# Altium schematic sheet ESP32-C3_V01.SchDoc: ESP32-C3 Haptic Motor
size A3; Author: Dwayne Herzberg; DrawnBy: Dwayne Herzberg; Revision: V1; SheetNumber: 1; SheetTotal: 1
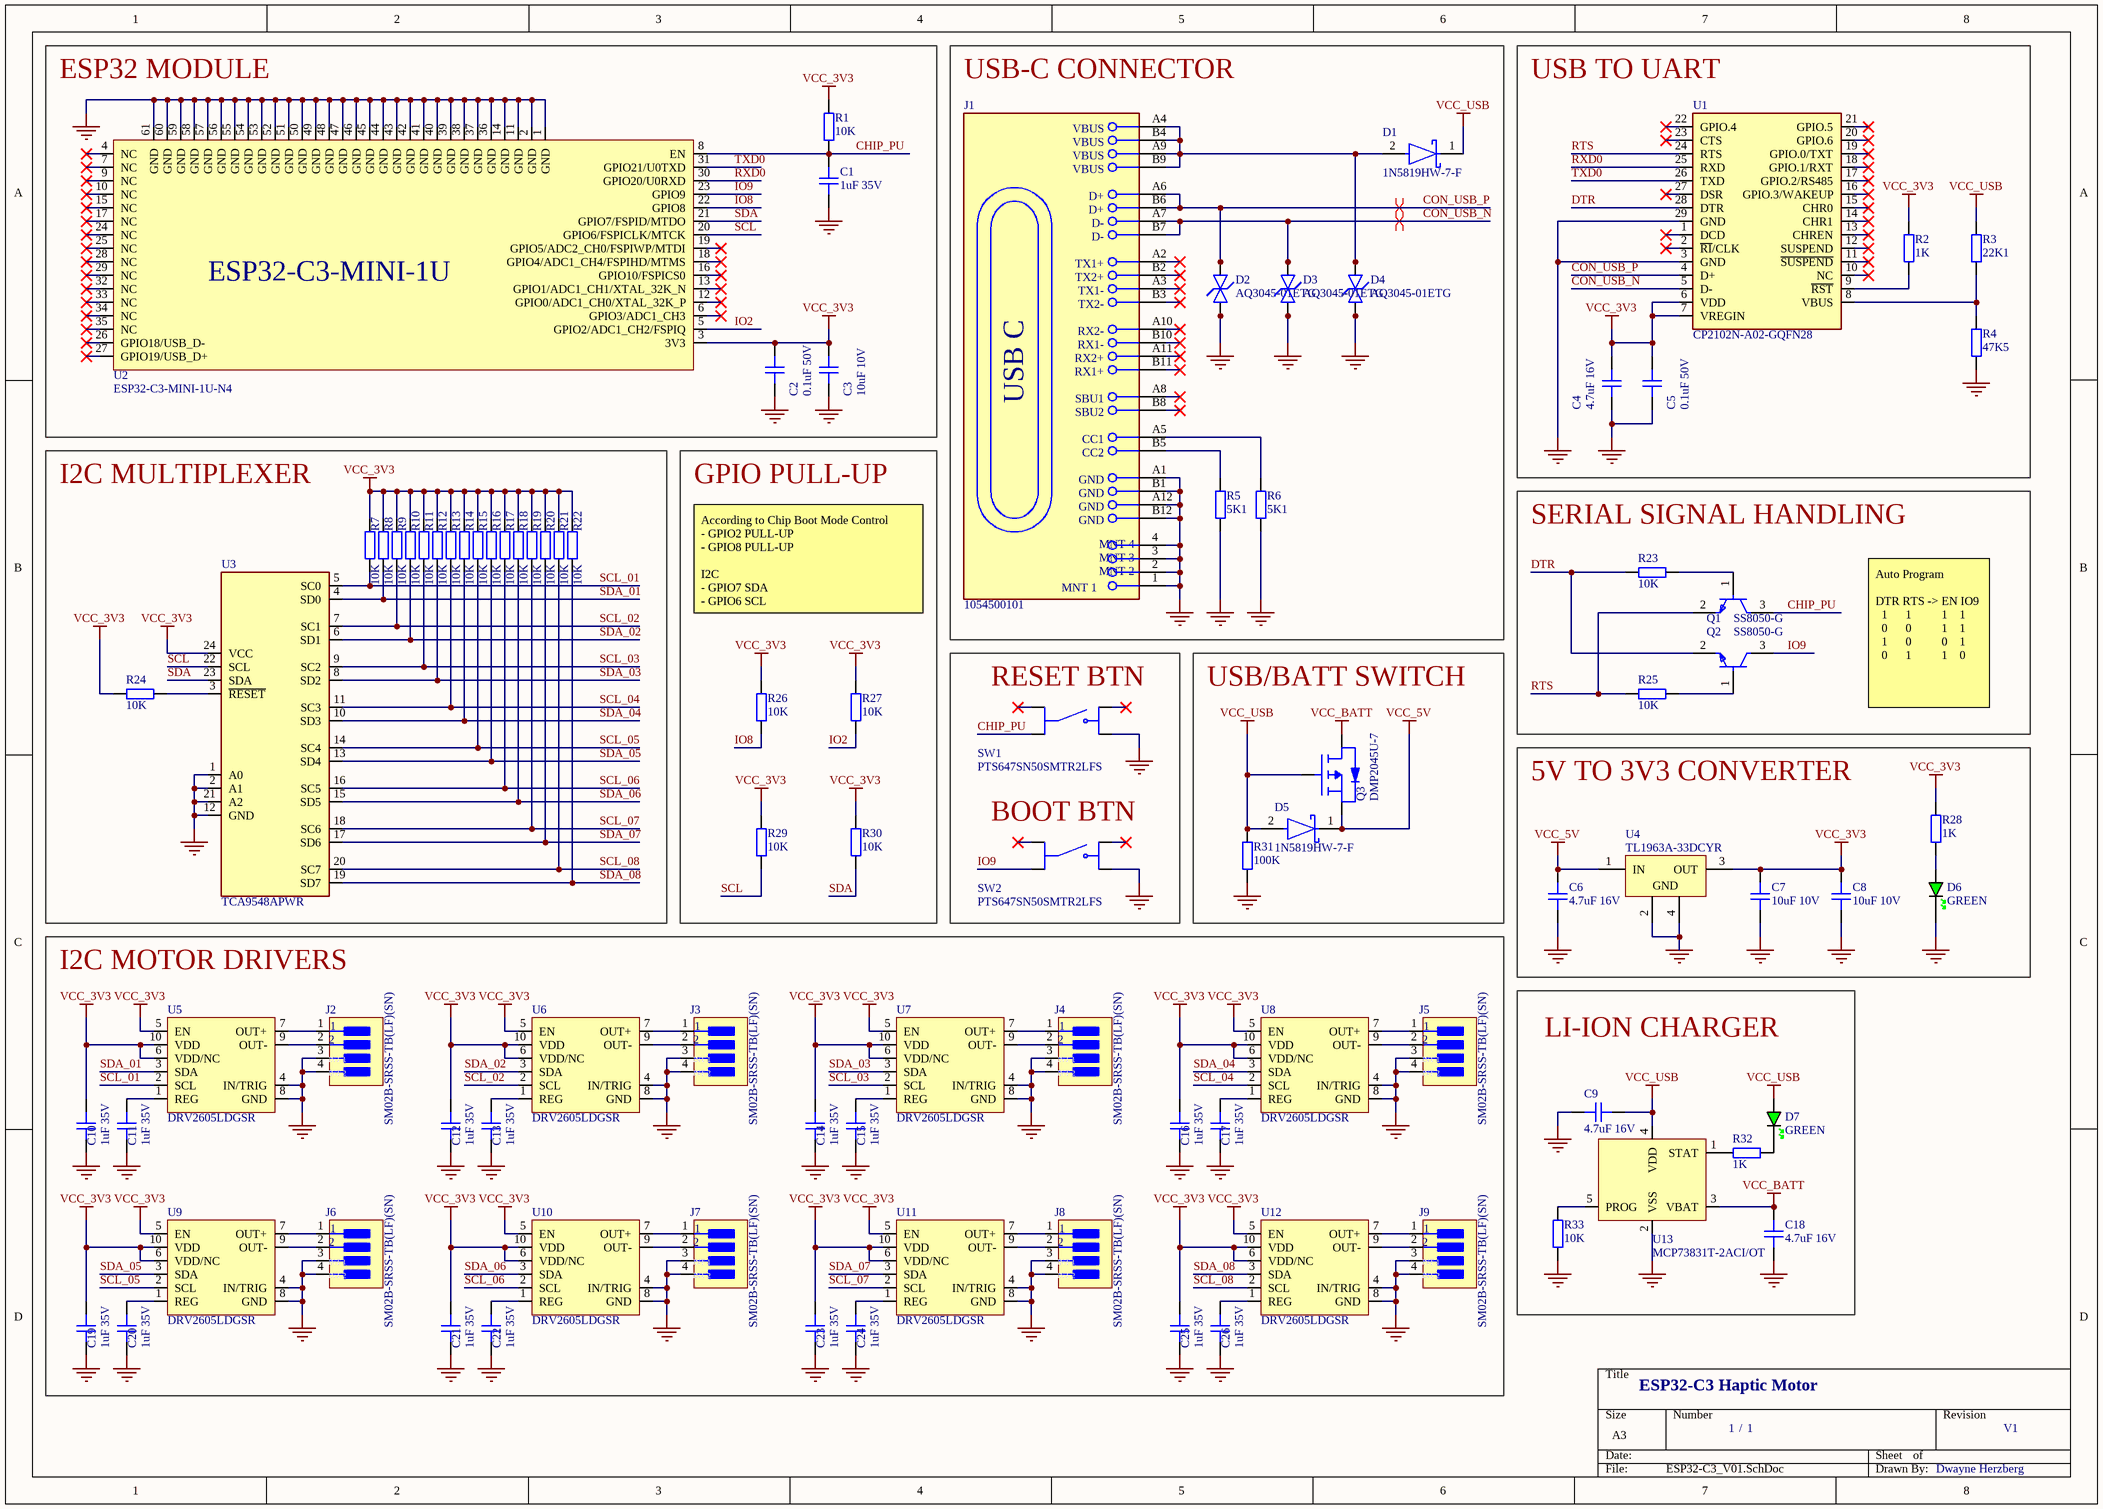
[diagram p0: ESP32-C3_V01.SchDoc]

## Parts
C1  1uF 35V  [CAP_0402]
C2  0.1uF 50V  [CAP_0402]
C3  10uF 10V  [CAP_0402]
C4  4.7uF 16V  [CAP_0402]
C5  0.1uF 50V  [CAP_0402]
C6  4.7uF 16V  [CAP_0402]
C7  10uF 10V  [CAP_0402]
C8  10uF 10V  [CAP_0402]
C9  4.7uF 16V  [CAP_0402]
C10  1uF 35V  [CAP_0402]
C11  1uF 35V  [CAP_0402]
C12  1uF 35V  [CAP_0402]
C13  1uF 35V  [CAP_0402]
C14  1uF 35V  [CAP_0402]
C15  1uF 35V  [CAP_0402]
C16  1uF 35V  [CAP_0402]
C17  1uF 35V  [CAP_0402]
C18  4.7uF 16V  [CAP_0402]
C19  1uF 35V  [CAP_0402]
C20  1uF 35V  [CAP_0402]
C21  1uF 35V  [CAP_0402]
C22  1uF 35V  [CAP_0402]
C23  1uF 35V  [CAP_0402]
C24  1uF 35V  [CAP_0402]
C25  1uF 35V  [CAP_0402]
C26  1uF 35V  [CAP_0402]
D1  1N5819HW-7-F  [FP-SOD123-IPC_B]
D2  AQ3045-01ETG  [SP353001ETG]
D3  AQ3045-01ETG  [SP353001ETG]
D4  AQ3045-01ETG  [SP353001ETG]
D5  1N5819HW-7-F  [FP-SOD123-IPC_B]
D6  GREEN  [LED_0603_GREEN]
D7  GREEN  [LED_0603_GREEN]
J1  1054500101  [FP-1054500101-MFG]
J2  SM02B-SRSS-TB(LF)(SN)  [FP-SM02B-SRSS-TB_LF_SN-MFG]
J3  SM02B-SRSS-TB(LF)(SN)  [FP-SM02B-SRSS-TB_LF_SN-MFG]
J4  SM02B-SRSS-TB(LF)(SN)  [FP-SM02B-SRSS-TB_LF_SN-MFG]
J5  SM02B-SRSS-TB(LF)(SN)  [FP-SM02B-SRSS-TB_LF_SN-MFG]
J6  SM02B-SRSS-TB(LF)(SN)  [FP-SM02B-SRSS-TB_LF_SN-MFG]
J7  SM02B-SRSS-TB(LF)(SN)  [FP-SM02B-SRSS-TB_LF_SN-MFG]
J8  SM02B-SRSS-TB(LF)(SN)  [FP-SM02B-SRSS-TB_LF_SN-MFG]
J9  SM02B-SRSS-TB(LF)(SN)  [FP-SM02B-SRSS-TB_LF_SN-MFG]
Q1  SS8050-G  [FP-SS8050-G-IPC_B]
Q2  SS8050-G  [FP-SS8050-G-IPC_B]
Q3  DMP2045U-7  [SOT96P240X115-3N]
R1  10K  [RES_0402]
R2  1K  [RES_0402]
R3  22K1  [RES_0402]
R4  47K5  [RES_0402]
R5  5K1  [RES_0402]
R6  5K1  [RES_0402]
R7  10K  [RES_0402]
R8  10K  [RES_0402]
R9  10K  [RES_0402]
R10  10K  [RES_0402]
R11  10K  [RES_0402]
R12  10K  [RES_0402]
R13  10K  [RES_0402]
R14  10K  [RES_0402]
R15  10K  [RES_0402]
R16  10K  [RES_0402]
R17  10K  [RES_0402]
R18  10K  [RES_0402]
R19  10K  [RES_0402]
R20  10K  [RES_0402]
R21  10K  [RES_0402]
R22  10K  [RES_0402]
R23  10K  [RES_0402]
R24  10K  [RES_0402]
R25  10K  [RES_0402]
R26  10K  [RES_0402]
R27  10K  [RES_0402]
R28  1K  [RES_0402]
R29  10K  [RES_0402]
R30  10K  [RES_0402]
R31  100K  [RES_0402]
R32  1K  [RES_0402]
R33  10K  [RES_0402]
SW1  PTS647SN50SMTR2LFS  [PTS 647 SN50 SMTR2 LFS]
SW2  PTS647SN50SMTR2LFS  [PTS 647 SN50 SMTR2 LFS]
U1  CP2102N-A02-GQFN28  [FP-CP2102N-A02-GQFN28-IPC_B]
U2  ESP32-C3-MINI-1U-N4  [ESP32-C3-MINI-1U_EXP]
U3  TCA9548APWR  [FP-PW0024A-IPC_B]
U4  TL1963A-33DCYR  [DCY0004A_L]
U5  DRV2605LDGSR  [FP-DGS0010A-IPC_B]
U6  DRV2605LDGSR  [FP-DGS0010A-IPC_B]
U7  DRV2605LDGSR  [FP-DGS0010A-IPC_B]
U8  DRV2605LDGSR  [FP-DGS0010A-IPC_B]
U9  DRV2605LDGSR  [FP-DGS0010A-IPC_B]
U10  DRV2605LDGSR  [FP-DGS0010A-IPC_B]
U11  DRV2605LDGSR  [FP-DGS0010A-IPC_B]
U12  DRV2605LDGSR  [FP-DGS0010A-IPC_B]
U13  MCP73831T-2ACI/OT  [FP-C04-091-OT-IPC_B]

## Blocks framed on the sheet
ESP32 MODULE: C1-C3 R1 U2
USB-C CONNECTOR: D1-D4 J1 R5 R6
USB TO UART: C4 C5 R2-R4 U1
I2C MULTIPLEXER: R7-R22 R24 U3
GPIO PULL-UP: R26 R27 R29 R30
SERIAL SIGNAL HANDLING: Q1 Q2 R23 R25
USB/BATT SWITCH: D5 Q3 R31
5V TO 3V3 CONVERTER: C6-C8 D6 R28 U4
I2C MOTOR DRIVERS: C10-C17 C19-C26 J2-J9 U5-U12
LI-ION CHARGER: C9 C18 D7 R32 R33 U13

## Nets
GND: C1.1 C2.1 C3.1 C4.1 C5.1 C6.1 C7.1 C8.1 C9.2 C10.1 C11.1 C12.1 C13.1 C14.1 C15.1 C16.1 C17.1 C18.2 C19.1 C20.1 C21.1 C22.1 C23.1 C24.1 C25.1 C26.1 D2.1(A) D2.A D3.1(A) D3.A D4.1(A) D4.A D6.K J1.1(MNT_1) J1.2(MNT_2) J1.3(MNT_3) J1.4(MNT_4) J1.A1(GND) J1.A12(GND) J1.B1(GND) J1.B12(GND) J2.3(MNT_1) J2.4(MNT_2) J3.3(MNT_1) J3.4(MNT_2) J4.3(MNT_1) J4.4(MNT_2) J5.3(MNT_1) J5.4(MNT_2) J6.3(MNT_1) J6.4(MNT_2) J7.3(MNT_1) J7.4(MNT_2) J8.3(MNT_1) J8.4(MNT_2) J9.3(MNT_1) J9.4(MNT_2) R4.1 R5.1 R6.1 R31.1 R33.1 SW1.4(NO) SW2.4(NO) U1.3(GND) U1.29(GND) U2.1(GND) U2.2(GND) U2.11(GND) U2.14(GND) U2.36(GND) U2.37(GND) U2.38(GND) U2.39(GND) U2.40(GND) U2.41(GND) U2.42(GND) U2.43(GND) U2.44(GND) U2.45(GND) U2.46(GND) U2.47(GND) U2.48(GND) U2.49(GND) U2.50(GND) U2.51(GND) U2.52(GND) U2.53(GND) U2.54(GND) U2.55(GND) U2.56(GND) U2.57(GND) U2.58(GND) U2.59(GND) U2.60(GND) U2.61(GND) U3.1(A0) U3.2(A1) U3.12(GND) U3.21(A2) U4.2(GND) U4.4(GND) U5.4(IN/TRIG) U5.8(GND) U6.4(IN/TRIG) U6.8(GND) U7.4(IN/TRIG) U7.8(GND) U8.4(IN/TRIG) U8.8(GND) U9.4(IN/TRIG) U9.8(GND) U10.4(IN/TRIG) U10.8(GND) U11.4(IN/TRIG) U11.8(GND) U12.4(IN/TRIG) U12.8(GND) U13.2(VSS)
VCC_3V3: C2.2 C3.2 C4.2 C5.2 C7.2 C8.2 C10.2 C12.2 C14.2 C16.2 C19.2 C21.2 C23.2 C25.2 R1.2 R2.2 R7.2 R8.2 R9.2 R10.2 R11.2 R12.2 R13.2 R14.2 R15.2 R16.2 R17.2 R18.2 R19.2 R20.2 R21.2 R22.2 R24.2 R26.2 R27.2 R28.2 R29.2 R30.2 U1.6(VDD) U1.7(VREGIN) U2.3(3V3) U3.24(VCC) U4.3(OUT) U5.5(EN) U5.6(VDD/NC) U5.10(VDD) U6.5(EN) U6.6(VDD/NC) U6.10(VDD) U7.5(EN) U7.6(VDD/NC) U7.10(VDD) U8.5(EN) U8.6(VDD/NC) U8.10(VDD) U9.5(EN) U9.6(VDD/NC) U9.10(VDD) U10.5(EN) U10.6(VDD/NC) U10.10(VDD) U11.5(EN) U11.6(VDD/NC) U11.10(VDD) U12.5(EN) U12.6(VDD/NC) U12.10(VDD)
VCC_5V: C6.2 D5.1(C) Q3.2(S) U4.1(IN)
VCC_BATT: C18.1 Q3.3(D) U13.3(VBAT)
VCC_USB: C9.1 D1.1(C) D5.2(A) D7.A Q3.1(G) R3.2 R31.2 U13.4(VDD)
CHIP_PU: C1.2 Q1.3(C) R1.1 SW1.3(NO) U2.8(EN)
CON_USB_N: D3.2(K) D3.K J1.A7(D-) J1.B7(D-) U1.5(D-)
CON_USB_P: D2.2(K) D2.K J1.A6(D+) J1.B6(D+) U1.4(D+)
DTR: Q2.2(E) R23.2 U1.28(DTR)
IO2: R27.1 U2.5(GPIO2/ADC1_CH2/FSPIQ)
IO8: R26.1 U2.22(GPIO8)
IO9: Q2.3(C) SW2.3(NO) U2.23(GPIO9)
RTS: Q1.2(E) R25.2 U1.24(RTS)
RXD0: U1.25(RXD) U2.30(GPIO20/U0RXD)
SCL: R29.1 U2.20(GPIO6/FSPICLK/MTCK) U3.22(SCL)
SCL_01: R7.1 U3.5(SC0) U5.2(SCL)
SCL_02: R9.1 U3.7(SC1) U6.2(SCL)
SCL_03: R11.1 U3.9(SC2) U7.2(SCL)
SCL_04: R13.1 U3.11(SC3) U8.2(SCL)
SCL_05: R15.1 U3.14(SC4) U9.2(SCL)
SCL_06: R17.1 U3.16(SC5) U10.2(SCL)
SCL_07: R19.1 U3.18(SC6) U11.2(SCL)
SCL_08: R21.1 U3.20(SC7) U12.2(SCL)
SDA: R30.1 U2.21(GPIO7/FSPID/MTDO) U3.23(SDA)
SDA_01: R8.1 U3.4(SD0) U5.3(SDA)
SDA_02: R10.1 U3.6(SD1) U6.3(SDA)
SDA_03: R12.1 U3.8(SD2) U7.3(SDA)
SDA_04: R14.1 U3.10(SD3) U8.3(SDA)
SDA_05: R16.1 U3.13(SD4) U9.3(SDA)
SDA_06: R18.1 U3.15(SD5) U10.3(SDA)
SDA_07: R20.1 U3.17(SD6) U11.3(SDA)
SDA_08: R22.1 U3.19(SD7) U12.3(SDA)
TXD0: U1.26(TXD) U2.31(GPIO21/U0TXD)
NetC11_2: C11.2 U5.1(REG)
NetC13_2: C13.2 U6.1(REG)
NetC15_2: C15.2 U7.1(REG)
NetC17_2: C17.2 U8.1(REG)
NetC20_2: C20.2 U9.1(REG)
NetC22_2: C22.2 U10.1(REG)
NetC24_2: C24.2 U11.1(REG)
NetC26_2: C26.2 U12.1(REG)
NetD1_2: D1.2(A) D4.2(K) D4.K J1.A4(VBUS) J1.A9(VBUS) J1.B4(VBUS) J1.B9(VBUS)
NetD6_A: D6.A R28.1
NetD7_K: D7.K R32.1
NetJ1_A5: J1.A5(CC1) R6.2
NetJ1_B5: J1.B5(CC2) R5.2
NetJ2_1: J2.1 U5.7(OUT+)
NetJ2_2: J2.2 U5.9(OUT-)
NetJ3_1: J3.1 U6.7(OUT+)
NetJ3_2: J3.2 U6.9(OUT-)
NetJ4_1: J4.1 U7.7(OUT+)
NetJ4_2: J4.2 U7.9(OUT-)
NetJ5_1: J5.1 U8.7(OUT+)
NetJ5_2: J5.2 U8.9(OUT-)
NetJ6_1: J6.1 U9.7(OUT+)
NetJ6_2: J6.2 U9.9(OUT-)
NetJ7_1: J7.1 U10.7(OUT+)
NetJ7_2: J7.2 U10.9(OUT-)
NetJ8_1: J8.1 U11.7(OUT+)
NetJ8_2: J8.2 U11.9(OUT-)
NetJ9_1: J9.1 U12.7(OUT+)
NetJ9_2: J9.2 U12.9(OUT-)
NetQ1_1: Q1.1(B) R23.1
NetQ2_1: Q2.1(B) R25.1
NetR2_1: R2.1 U1.9(~{RST})
NetR3_1: R3.1 R4.2 U1.8(VBUS)
NetR24_1: R24.1 U3.3(~{RESET})
NetR32_2: R32.2 U13.1(STAT)
NetR33_2: R33.2 U13.5(PROG)

Not connected (* = marked no-connect by the designer): J1 A2(TX1+)* A3(TX1-)* A8(SBU1)* A10(RX2-)* A11(RX2+)* B2(TX2+)* B3(TX2-)* B8(SBU2)* B10(RX1-)* B11(RX1+)*; SW1 1(NO)* 2(NO)*; SW2 1(NO)* 2(NO)*; U1 1(DCD)* 2(~{RI}/CLK)* 10(NC)* 11(~{SUSPEND})* 12(SUSPEND)* 13(CHREN)* 14(CHR1)* 15(CHR0)* 16(GPIO.3/WAKEUP)* 17(GPIO.2/RS485)* 18(GPIO.1/RXT)* 19(GPIO.0/TXT)* 20(GPIO.6)* 21(GPIO.5)* 22(GPIO.4)* 23(CTS)* 27(DSR)*; U2 4(NC)* 6(GPIO3/ADC1_CH3)* 7(NC)* 9(NC)* 10(NC)* 12(GPIO0/ADC1_CH0/XTAL_32K_P)* 13(GPIO1/ADC1_CH1/XTAL_32K_N)* 15(NC)* 16(GPIO10/FSPICS0)* 17(NC)* 18(GPIO4/ADC1_CH4/FSPIHD/MTMS)* 19(GPIO5/ADC2_CH0/FSPIWP/MTDI)* 24(NC)* 25(NC)* 26(GPIO18/USB_D-)* 27(GPIO19/USB_D+)* 28(NC)* 29(NC)* 32(NC)* 33(NC)* 34(NC)* 35(NC)*

## Layout directives
differential pair: CON_USB_N, CON_USB_P

## Notes on the sheet
- According to Chip Boot Mode Control
  - GPIO2 PULL-UP
  - GPIO8 PULL-UP
  I2C
  - GPIO7 SDA
  - GPIO6 SCL
- (near SW1) RESET BTN
- Auto Program
  DTR RTS -> EN IO9
  1      1          1    1
  0      0          1    1
  1      0          0    1
  0      1          1    0
- (near SW2) BOOT BTN
- /
- (in symbol CMP-04767-000004-1) USB C
- (in symbol ESP32-C3-MINI-1U-N4) ESP32-C3-MINI-1U

## Library data of the parts
C1 C10-C17 C19-C26 = CL05A105KL5NRNC: CAP CER 1UF 35V X5R 0402; Manufacturer: Samsung; Dielectric Material: Ceramic; Multilayer: Yes; Tolerance  (fill in as +-): 10%; Supplier: Digikey; Supplier Part Number: 1276-6796-1-ND; Manufacturer Part Number: CL05A105KL5NRNC; RoHS: Yes; Category: Ceramic Capacitors; Stock: 232722; Pricing: 1=0,31, 10=0,182, 50=0,13, 100=0,114, 500=0,08684, 1000=0,07837, 2500=0,06938, 5000=0,06393 (USD); Mounting Technology: Surface Mount; Pins: 2; Package Shape: Rectangular; Case/Package: 0402; Terminal Finish: Nickel; Min Operating Temperature: -55°C; Max Operating Temperature: 85°C; JESD-609 Code: e3; Value: 1uF; Capacitor Type: Ceramic; Packaging: Tape and Reel; Tolerance (fill in as +-): 10%; Rated DC Voltage (URdc): 35V; Temperature Characteristics Code: X5R; Termination: Wraparound; Reach SVHC Compliant: Yes; RoHS Compliant: Yes; ComponentLink1URL: https://datasheet.ciiva.com:443/pdfs/VipMasterIC/IC/SEMS/SEMS-S-A0008384515/SEMS-S-A0008872905-1.pdf?src-supplier=IHS+Markit; ComponentLink1Description: https://datasheet.ciiva.com:443/pdfs/VipMasterIC/IC/SEMS/SEMS-S-A0008384515/SEMS-S-A0008872905-1.pdf?src-supplier=IHS+Markit; ComponentLink2URL: http://www.samsungsem.com/kr/support/product-search/mlcc/CL05A105KL5NRNC.jsp?src-supplier=Digikey; ComponentLink2Description: http://www.samsungsem.com/kr/support/product-search/mlcc/CL05A105KL5NRNC.jsp?src-supplier=Digikey; JLCPCB Part: C307413
C2 C5 = CL05B104KB54PNC: CAP CER 0.1UF 50V X7R 0402; Manufacturer: Samsung; Dielectric Material: Ceramic; Supplier: Digikey; Supplier Part Number: 1276-CL05B104KB54PNCCT-ND; Manufacturer Part Number: CL05B104KB54PNC; RoHS: Yes; Category: Ceramic Capacitors; Stock: 1548472; Pricing: 1=0,1, 10=0,036, 50=0,0246, 100=0,021, 500=0,01498, 1000=0,01311, 2500=0,01114, 5000=0,00995 (USD); Pins: 2; Capacitor Type: Ceramic; RoHS Compliant: Yes; Reach SVHC Compliant: Yes; ComponentLink1URL: https://datasheet.ciiva.com:443/pdfs/VipMasterIC/IC/SEMS/SEMS-S-A0006318249/SEMS-S-A0006320959-1.pdf?src-supplier=IHS+Markit; ComponentLink1Description: https://datasheet.ciiva.com:443/pdfs/VipMasterIC/IC/SEMS/SEMS-S-A0006318249/SEMS-S-A0006320959-1.pdf?src-supplier=IHS+Markit; ComponentLink2URL: https://datasheet.octopart.com/CL05B104KB54PNC-Samsung-datasheet-8326407.pdf?src-supplier=TME; ComponentLink2Description: https://datasheet.octopart.com/CL05B104KB54PNC-Samsung-datasheet-8326407.pdf?src-supplier=TME; JLCPCB Part: C307331
C3 C7 C8 = CL05A106MP8NUB8: CAP CER 10UF 10V X5R 0402; Manufacturer: Samsung; Dielectric Material: Ceramic; Multilayer: Yes; Tolerance  (fill in as +-): 20%; Supplier: Digikey; Supplier Part Number: 1276-6830-1-ND; Manufacturer Part Number: CL05A106MP8NUB8; RoHS: Yes; Category: Ceramic Capacitors; Stock: 286147; Pricing: 1=0,26, 10=0,121, 50=0,1012, 100=0,0816, 500=0,0752, 1000=0,0688, 2500=0,0584 (USD); Mounting Technology: Surface Mount; Pins: 2; Package Shape: Rectangular; Case/Package: 0402; Terminal Finish: Nickel; Min Operating Temperature: -55°C; Max Operating Temperature: 85°C; JESD-609 Code: e3; Value: 10uF; Capacitor Type: Ceramic; Packaging: Tape and Reel; Tolerance (fill in as +-): 20%; Rated DC Voltage (URdc): 10V; Temperature Characteristics Code: X5R; Termination: Wraparound; Reach SVHC Compliant: Yes; RoHS Compliant: Yes; ComponentLink1URL: https://datasheet.ciiva.com:443/pdfs/VipMasterIC/IC/SEMS/SEMS-S-A0008521219/SEMS-S-A0008521325-1.pdf?src-supplier=IHS+Markit; ComponentLink1Description: https://datasheet.ciiva.com:443/pdfs/VipMasterIC/IC/SEMS/SEMS-S-A0008521219/SEMS-S-A0008521325-1.pdf?src-supplier=IHS+Markit; ComponentLink2URL: http://www.samsungsem.com/kr/support/product-search/mlcc/CL05A106MP8NUB8.jsp?src-supplier=Digikey; ComponentLink2Description: http://www.samsungsem.com/kr/support/product-search/mlcc/CL05A106MP8NUB8.jsp?src-supplier=Digikey; ComponentLink3URL: https://datasheet.octopart.com/CL05A106MP8NUB8-Samsung-Electro-Mechanics-datasheet-136460857.pdf?src-supplier=Future+Electronics; ComponentLink3Description: https://datasheet.octopart.com/CL05A106MP8NUB8-Samsung-Electro-Mechanics-datasheet-136460857.pdf?src-supplier=Future+Electronics; JLCPCB Part: C307415
C4 C6 C9 C18 = CL05A475MO5NUNC: CAP CER 4.7UF 16V X5R 0402; Manufacturer: Samsung; Dielectric Material: Ceramic; Multilayer: Yes; Tolerance  (fill in as +-): 20%; Supplier: Digikey; Supplier Part Number: 1276-6836-1-ND; Manufacturer Part Number: CL05A475MO5NUNC; RoHS: Yes; Category: Ceramic Capacitors; Stock: 86895; Pricing: 1=0,31, 10=0,146, 50=0,1232, 100=0,1, 500=0,0952, 1000=0,0904, 2500=0,0752 (USD); Mounting Technology: Surface Mount; Pins: 2; Package Shape: Rectangular; Case/Package: 0402; Terminal Finish: Nickel; Min Operating Temperature: -55°C; Max Operating Temperature: 85°C; JESD-609 Code: e3; Value: 4.7uF; Capacitor Type: Ceramic; Package Style: SMTMeter; Packaging: Tape and Reel; Tolerance (fill in as +-): 20%; Rated DC Voltage (URdc): 16V; Temperature Characteristics Code: X5R; Termination: Wraparound; Length: 1mm; Width: 0.5mm; Height: 0.7mm; Reach SVHC Compliant: Yes; RoHS Compliant: Yes; ComponentLink1URL: https://datasheet.ciiva.com:443/pdfs/VipMasterIC/IC/SEMS/SEMS-S-A0008384515/SEMS-S-A0008898881-1.pdf?src-supplier=IHS+Markit; ComponentLink1Description: https://datasheet.ciiva.com:443/pdfs/VipMasterIC/IC/SEMS/SEMS-S-A0008384515/SEMS-S-A0008898881-1.pdf?src-supplier=IHS+Markit; ComponentLink2URL: http://www.farnell.com/datasheets/2710653.pdf?src-supplier=Farnell; ComponentLink2Description: http://www.farnell.com/datasheets/2710653.pdf?src-supplier=Farnell; ComponentLink3URL: http://www.samsungsem.com/kr/support/product-search/mlcc/CL05A475MO5NUNC.jsp?src-supplier=Digikey; ComponentLink3Description: http://www.samsungsem.com/kr/support/product-search/mlcc/CL05A475MO5NUNC.jsp?src-supplier=Digikey; ComponentLink4URL: http://www.farnell.com/datasheets/2710653.pdf?src-supplier=Newark; ComponentLink4Description: http://www.farnell.com/datasheets/2710653.pdf?src-supplier=Newark; ComponentLink5URL: http://www.farnell.com/datasheets/2710653.pdf?src-supplier=Element14; ComponentLink5Description: http://www.farnell.com/datasheets/2710653.pdf?src-supplier=Element14; JLCPCB Part: C318563
D1 D5 = 1N5819HW-7-F: DIODE SCHOTTKY 40V 1A SOD123; Manufacturer: Diodes; Diode Element Material: SILICON; Package Body Material: Plastic; Diode Type: RECTIFIER; Number of Elements: 1; Max Power Dissipation: 450mW; Forward Voltage: 320mV; Non-rep Pk Forward Current-Max: 25A; Time @ Peak Reflow Temperature-Max (s): 40s; Qualification Status: Not Qualified; Supplier: Rs; Supplier Part Number: 7082197P; Manufacturer Part Number: 1N5819HW-7-F; RoHS: Yes; Category: LDO; Stock: 273725; Pricing: 150=0,172, 750=0,114, 1500=0,088 (EUR); Pins: 2; Package Shape: Rectangular; Terminal Finish: Tin; Min Operating Temperature: -65°C; Max Operating Temperature: 125°C; JESD-30 Code: R-PDSO-G2; Max Output current: 1A; Package Style: SMALL OUTLINEMeter; Rep Pk Reverse Voltage-Max: 40V; Surface Mount: Yes; Technology: SCHOTTKY; Terminal Form: Gull Wing; Terminal Position: DUAL; JESD-609 Code: e3; Moisture Sensitivity Level: 1; Peak Reflow Temperature (Cel): 260°C; Reach SVHC Compliant: Yes; RoHS Compliant: Yes; ComponentLink1URL: https://datasheet.ciiva.com:443/pdfs/VipMasterIC/IC/DIOD/DIOD-S-A0009689747/DIOD-S-A0009691035-1.pdf?src-supplier=IHS+Markit; ComponentLink1Description: https://datasheet.ciiva.com:443/pdfs/VipMasterIC/IC/DIOD/DIOD-S-A0009689747/DIOD-S-A0009691035-1.pdf?src-supplier=IHS+Markit; ComponentLink2URL: https://datasheet.ciiva.com/27092/1538419-27092484.pdf?src-supplier=Jameco; ComponentLink2Description: https://datasheet.ciiva.com/27092/1538419-27092484.pdf?src-supplier=Jameco; ComponentLink3URL: https://datasheet.ciiva.com/16303/ds30217-16303296.pdf?src-supplier=Future+Electronics; ComponentLink3Description: https://datasheet.ciiva.com/16303/ds30217-16303296.pdf?src-supplier=Future+Electronics; ComponentLink4URL: https://datasheet.ciiva.com/1177/ds30217-1177089.pdf?src-supplier=Element14; ComponentLink4Description: https://datasheet.ciiva.com/1177/ds30217-1177089.pdf?src-supplier=Element14; ComponentLink5URL: https://datasheet.ciiva.com/8303/ds30217-8303132.pdf?src-supplier=Avnet; ComponentLink5Description: https://datasheet.ciiva.com/8303/ds30217-8303132.pdf?src-supplier=Avnet; ComponentLink6URL: https://datasheet.ciiva.com/912/ds30217-912802.pdf?src-supplier=Digikey; ComponentLink6Description: https://datasheet.ciiva.com/912/ds30217-912802.pdf?src-supplier=Digikey; ComponentLink7URL: https://datasheet.ciiva.com/912/ds30217-912803.pdf?src-supplier=Digikey; ComponentLink7Description: https://datasheet.ciiva.com/912/ds30217-912803.pdf?src-supplier=Digikey; ComponentLink8URL: https://datasheet.ciiva.com/912/ds30217-912801.pdf?src-supplier=Digikey; ComponentLink8Description: https://datasheet.ciiva.com/912/ds30217-912801.pdf?src-supplier=Digikey; JLCPCB Part: C82544
D2-D4 = AQ3045-01ETG: TVS DIODE 5.3VWM 12VC SOD882; Manufacturer: Littelfuse; Diode Element Material: SILICON; Package Body Material: Plastic; Polarity: Bidirectional; Max Breakdown Voltage: 9V; Min Breakdown Voltage: 6.8V; Diode Type: TRANS VOLTAGE SUPPRESSOR; Non-rep Peak Rev Power Dis-Max: 40W; Number of Elements: 1; Rep Pk Reverse Voltage-Max: 5.3V; Reference Standard: AEC-Q101; Supplier: Digikey; Supplier Part Number: F9321CT-ND; Manufacturer Part Number: AQ3045-01ETG; RoHS: Yes; Category: TVS Diodes; Stock: 16662; Pricing: 1=0,48, 10=0,321, 100=0,17, 500=0,152, 1000=0,134, 2000=0,13, 5000=0,126 (USD); Pins: 2; Package Shape: Rectangular; Min Operating Temperature: -55°C; Max Operating Temperature: 150°C; Package Style: CHIP CARRIERMeter; Surface Mount: Yes; Technology: AVALANCHE; Terminal Form: No Lead; Terminal Position: BOTTOM; Reach SVHC Compliant: Yes; RoHS Compliant: Yes; ComponentLink1URL: https://datasheet.ciiva.com:443/pdfs/VipMasterIC/IC/LFSI/LFSI-S-A0007892042/LFSI-S-A0007892042-1.pdf?src-supplier=IHS+Markit; ComponentLink1Description: https://datasheet.ciiva.com:443/pdfs/VipMasterIC/IC/LFSI/LFSI-S-A0007892042/LFSI-S-A0007892042-1.pdf?src-supplier=IHS+Markit; ComponentLink2URL: https://www.littelfuse.com/~/media/electronics/datasheets/tvs_diode_arrays/littelfuse_tvs_diode_array_aq3045_datasheet.pdf.pdf?src-supplier=Digikey; ComponentLink2Description: https://www.littelfuse.com/~/media/electronics/datasheets/tvs_diode_arrays/littelfuse_tvs_diode_array_aq3045_datasheet.pdf.pdf?src-supplier=Digikey; ComponentLink3URL: http://www.littelfuse.com/~/media/electronics/datasheets/tvs_diode_arrays/littelfuse_tvs_diode_array_aq3045_datasheet.pdf.pdf?src-supplier=Digikey; ComponentLink3Description: http://www.littelfuse.com/~/media/electronics/datasheets/tvs_diode_arrays/littelfuse_tvs_diode_array_aq3045_datasheet.pdf.pdf?src-supplier=Digikey; JLCPCB Part: C3710326
D6 D7 = 150060GS75000: LED GREEN CLEAR 0603 SMD; Manufacturer: Wurth Electronics; Shape: Rectangular; Lens Style: WATER CLEAR; Forward Current: 30mA; Luminous Intensity-Nom: 430mcd; Channels: 1; Optoelectronic Device Type: SINGLE COLOR LED; Viewing Angle: 140°; Overall Height: 0.7mm; Supplier: Digikey; Supplier Part Number: 732-4971-1-ND; Manufacturer Part Number: 150060GS75000; RoHS: Yes; Category: LEDs; Stock: 127206; Pricing: 1=0,14, 50=0,1278, 100=0,1098, 500=0,10124 (USD); Mounting Technology: Surface Mount; Pins: 2; Color: Green; Min Operating Temperature: -40°C; Max Operating Temperature: 85°C; Packaging: Tape and Reel; Size: 1.1mm; Terminal Pitch: 1.6mm; Reach SVHC Compliant: Yes; RoHS Compliant: Yes; ComponentLink1URL: https://datasheet.ciiva.com:443/pdfs/VipMasterIC/IC/MIDC/MIDC-S-A0007790169/MIDC-S-A0007790169-1.pdf?src-supplier=IHS+Markit; ComponentLink1Description: https://datasheet.ciiva.com:443/pdfs/VipMasterIC/IC/MIDC/MIDC-S-A0007790169/MIDC-S-A0007790169-1.pdf?src-supplier=IHS+Markit; ComponentLink2URL: https://datasheet.ciiva.com/29562/150060gs75000-29562868.pdf?src-supplier=Digikey; ComponentLink2Description: https://datasheet.ciiva.com/29562/150060gs75000-29562868.pdf?src-supplier=Digikey; ComponentLink3URL: https://datasheet.ciiva.com/29279/759427-da-01-en-chipled-0603-w-kl-gruen-150060gs75000-29279201.pdf?src-supplier=Conrad; ComponentLink3Description: https://datasheet.ciiva.com/29279/759427-da-01-en-chipled-0603-w-kl-gruen-150060gs75000-29279201.pdf?src-supplier=Conrad; ComponentLink4URL: https://datasheet.ciiva.com/29562/150060gs75000-29562869.pdf?src-supplier=Digikey; ComponentLink4Description: https://datasheet.ciiva.com/29562/150060gs75000-29562869.pdf?src-supplier=Digikey; ComponentLink5URL: https://datasheet.ciiva.com/29562/150060gs75000-29562870.pdf?src-supplier=Digikey; ComponentLink5Description: https://datasheet.ciiva.com/29562/150060gs75000-29562870.pdf?src-supplier=Digikey; JLCPCB Part: C5252984
J1 = CMP-04767-000004-1: CONN RCP USB3.1 TYPEC 24P SMD RA; Manufacturer: Molex; Number Of Contacts: 24; Voltage Rating: 30V; Shielding: true; Is Female: yes; Current Rating: 0.25/1.25/5A; Pitch: 0.5mm; Conn Orientation: Right Angle; Package: 0; Height: 3.44mm; Footprint Url: https://www.molex.com/pdm_docs/sd/1054500101_sd.pdf; Device Class L1: Connectors; Category: Conn; Device Class L2: USB Connectors; Digikey Description: CONN RCP USB3.1 TYPEC 24P SMD RA; Contact Material: Gold,Nickel; Mouser Description: USB Shielded I/O Receptacle; Type C; Right Angle; Surface Mount; Gold over Nickel; ComponentLink2Description: Datasheet; Lead Free: Yes; Automotive: No; Temperature Range High: +85°C; RoHS: TRUE; Octopart: https://octopart.com/105450-0101-molex-68082325; ComponentLink2URL: https://www.molex.com/webdocs/datasheets/pdf/en-us/1054500101_IO_CONNECTORS.pdf; Temperature: -30°C to +85°C; Usb Standard: USB 3.1; Temperature Range Low: -30°C; Device Class L3: unset; Manufacturer Part Number: 1054500101; JLCPCB Part: C134092
J2-J9 = SM02B-SRSS-TB(LF)(SN): CONN HEADER SMD R/A 2POS 1MM; Manufacturer: JST; Supplier: Future Electronics; Supplier Part Number: 1161645; Manufacturer Part Number: SM02B-SRSS-TB(LF)(SN); RoHS: Yes; Category: Headers and Wire Housings; Stock: 36000; Pricing: 3000=0,184, 6000=0,181, 9000=0,179 (USD); ComponentLink1URL: https://datasheet.ciiva.com/26924/getdatasheetpartid-640850-26924055.pdf?src-supplier=Verical; ComponentLink1Description: https://datasheet.ciiva.com/26924/getdatasheetpartid-640850-26924055.pdf?src-supplier=Verical; ComponentLink2URL: https://datasheet.ciiva.com/8052/91630-8052284.pdf?src-supplier=Element14; ComponentLink2Description: https://datasheet.ciiva.com/8052/91630-8052284.pdf?src-supplier=Element14; ComponentLink3URL: https://datasheet.ciiva.com/712/esr-712467.pdf?src-supplier=Digikey; ComponentLink3Description: https://datasheet.ciiva.com/712/esr-712467.pdf?src-supplier=Digikey; ComponentLink4URL: https://datasheet.ciiva.com/712/esr-712468.pdf?src-supplier=Digikey; ComponentLink4Description: https://datasheet.ciiva.com/712/esr-712468.pdf?src-supplier=Digikey; ComponentLink5URL: https://datasheet.ciiva.com/730/esr-730600.pdf?src-supplier=Digikey; ComponentLink5Description: https://datasheet.ciiva.com/730/esr-730600.pdf?src-supplier=Digikey; ComponentLink6URL: https://datasheet.ciiva.com/16391/sm02b-srss-tblfsn-16391308.pdf?src-supplier=Future+Electronics; ComponentLink6Description: https://datasheet.ciiva.com/16391/sm02b-srss-tblfsn-16391308.pdf?src-supplier=Future+Electronics; JLCPCB Part: C160402
Q1 Q2 = SS8050-G: TRANS NPN 25V 1.5A SOT-23-3; Manufacturer: Comchip; Supplier: Digikey; Supplier Part Number: 641-1790-1-ND; Manufacturer Part Number: SS8050-G; RoHS: Yes; Category: Transistors; Stock: 130035; Pricing: 1=0,24, 10=0,148, 100=0,0921, 500=0,06754, 1000=0,05958 (USD); Reach SVHC Compliant: Yes; RoHS Compliant: Yes; ComponentLink1URL: https://datasheet.ciiva.com:443/pdfs/VipMasterIC/IC/COMC/COMC-S-A0004994192/COMC-S-A0004994192-1.pdf?src-supplier=IHS+Markit; ComponentLink1Description: https://datasheet.ciiva.com:443/pdfs/VipMasterIC/IC/COMC/COMC-S-A0004994192/COMC-S-A0004994192-1.pdf?src-supplier=IHS+Markit; ComponentLink2URL: http://www.comchiptech.com/admin/files/product/SS8050-G RevA181526.pdf?src-supplier=Digikey; ComponentLink2Description: http://www.comchiptech.com/admin/files/product/SS8050-G RevA181526.pdf?src-supplier=Digikey; JLCPCB Part: C3199946
Q3 = DMP2045U-7: MOSFET P-CH 20V 4.3A SOT23; Manufacturer: Diodes; Supplier: Rs; Supplier Part Number: 1827098P; Manufacturer Part Number: DMP2045U-7; RoHS: Yes; Category: MOSFETs; Stock: 64300; Pricing: 200=0,107, 500=0,085, 1000=0,077, 2000=0,071 (EUR); Reach SVHC Compliant: Yes; RoHS Compliant: Yes; ComponentLink1URL: https://datasheet.ciiva.com:443/pdfs/VipMasterIC/IC/DIOD/DIOD-S-A0007771249/DIOD-S-A0007771249-1.pdf?src-supplier=IHS+Markit; ComponentLink1Description: https://datasheet.ciiva.com:443/pdfs/VipMasterIC/IC/DIOD/DIOD-S-A0007771249/DIOD-S-A0007771249-1.pdf?src-supplier=IHS+Markit; ComponentLink2URL: https://datasheet.octopart.com/DMP2045U-7-Diodes-Inc.-datasheet-140438452.pdf?src-supplier=Newark; ComponentLink2Description: https://datasheet.octopart.com/DMP2045U-7-Diodes-Inc.-datasheet-140438452.pdf?src-supplier=Newark; ComponentLink3URL: https://www.diodes.com/assets/Datasheets/DMP2045U.pdf?src-supplier=Digikey; ComponentLink3Description: https://www.diodes.com/assets/Datasheets/DMP2045U.pdf?src-supplier=Digikey; ComponentLink4URL: https://datasheet.octopart.com/DMP2045U-7-Diodes-Inc.-datasheet-129878686.pdf?src-supplier=TME; ComponentLink4Description: https://datasheet.octopart.com/DMP2045U-7-Diodes-Inc.-datasheet-129878686.pdf?src-supplier=TME; JLCPCB Part: C459541
R1 R7-R27 R29 R30 R33 = AC0402FR-0710KL: RES SMD 10K OHM 1% 1/16W 0402; Manufacturer: Yageo; Additional Feature: LASER TRIMMABLE; Power: 62.5mW; Rated Temperature: 70°C; Value: 10kR; Working Voltage: 50V; Temperature Coefficient (ppm/Cel): 100; Package Height: 0.32mm; Package Length: 1mm; Package Width: 0.5mm; Reference Standard: AEC-Q200; Supplier: Digikey; Supplier Part Number: YAG3436CT-ND; Manufacturer Part Number: AC0402FR-0710KL; RoHS: Yes; Category: Chip SMD Resistors; Stock: 1219061; Pricing: 1=0,1, 10=0,01, 50=0,0086, 100=0,0071, 500=0,00612, 1000=0,0051, 5000=0,00408 (USD); Mounting Technology: Surface Mount; Pins: 2; Package Shape: Rectangular; Case/Package: 0402; Terminal Finish: Nickel; Min Operating Temperature: -55°C; Max Operating Temperature: 155°C; Tolerance: 1%; JESD-609 Code: e3; Resistor Type: FIXED RESISTOR; Construction: Chip; Packaging: Tape and Reel; Technology: METAL GLAZE/THICK FILM; Termination: Wraparound; Reach SVHC Compliant: Yes; RoHS Compliant: Yes; ComponentLink1URL: https://datasheet.ciiva.com:443/pdfs/VipMasterIC/IC/YAGO/YAGO-S-A0003597364/YAGO-S-A0003597364-1.pdf?src-supplier=IHS+Markit; ComponentLink1Description: https://datasheet.ciiva.com:443/pdfs/VipMasterIC/IC/YAGO/YAGO-S-A0003597364/YAGO-S-A0003597364-1.pdf?src-supplier=IHS+Markit; ComponentLink2URL: https://datasheet.ciiva.com/12656/pyu-ac-51-rohs-l-2-12656634.pdf?src-supplier=Mouser; ComponentLink2Description: https://datasheet.ciiva.com/12656/pyu-ac-51-rohs-l-2-12656634.pdf?src-supplier=Mouser; JLCPCB Part: C144807
R2 R28 R32 = RC0402JR-071KL: RES 1K OHM 5% 1/16W 0402; Manufacturer: Yageo; Additional Feature: LASER TRIMMABLE; Power: 62.5mW; Rated Temperature: 70°C; Value: 1kR; Working Voltage: 50V; Temperature Coefficient (ppm/Cel): 100; Package Height: 0.35mm; Package Length: 1mm; Package Width: 0.5mm; Supplier: Digikey; Supplier Part Number: 311-1.0KJRCT-ND; Manufacturer Part Number: RC0402JR-071KL; RoHS: Yes; Category: Chip SMD Resistors; Stock: 12327714; Pricing: 1=0,1, 10=0,009, 50=0,0076, 100=0,0061, 500=0,0056, 1000=0,0051, 5000=0,00408 (USD); Mounting Technology: Surface Mount; Pins: 2; Package Shape: Rectangular; Case/Package: 0402; Terminal Finish: Nickel; Min Operating Temperature: -55°C; Max Operating Temperature: 155°C; Tolerance: 5%; JESD-609 Code: e3; Resistor Type: FIXED RESISTOR; Construction: Chip; Packaging: Tape and Reel; Technology: METAL GLAZE/THICK FILM; Termination: Wraparound; Reach SVHC Compliant: Yes; RoHS Compliant: Yes; ComponentLink1URL: https://datasheet.ciiva.com:443/pdfs/VipMasterIC/IC/YAGO/YAGO-S-A0008145938/YAGO-S-A0008145938-1.pdf?src-supplier=IHS+Markit; ComponentLink1Description: https://datasheet.ciiva.com:443/pdfs/VipMasterIC/IC/YAGO/YAGO-S-A0008145938/YAGO-S-A0008145938-1.pdf?src-supplier=IHS+Markit; JLCPCB Part: C105637
R3 = RC0402FR-0722K1L: RES 22.1K OHM 1% 1/16W 0402; Manufacturer: Yageo; Additional Feature: LASER TRIMMABLE; Power: 62.5mW; Rated Temperature: 70°C; Value: 22.1kR; Working Voltage: 50V; Temperature Coefficient (ppm/Cel): 100; Package Height: 0.35mm; Package Length: 1mm; Package Width: 0.5mm; Supplier: Rs; Supplier Part Number: 1987704; Manufacturer Part Number: RC0402FR-0722K1L; RoHS: Yes; Category: Chip SMD Resistors; Stock: 5700; Pricing: 100=0,005, 1000=0,004, 2500=0,004, 5000=0,004, 10000=0,004 (EUR); Mounting Technology: Surface Mount; Pins: 2; Package Shape: Rectangular; Case/Package: 0402; Terminal Finish: Nickel; Min Operating Temperature: -55°C; Max Operating Temperature: 155°C; Tolerance: 1%; JESD-609 Code: e3; Packaging: Tape and Reel; Termination: Wraparound; Resistor Type: FIXED RESISTOR; Construction: Chip; Technology: METAL GLAZE/THICK FILM; Reach SVHC Compliant: Yes; RoHS Compliant: Yes; ComponentLink1URL: https://datasheet.ciiva.com:443/pdfs/VipMasterIC/IC/YAGO/YAGO-S-A0008145938/YAGO-S-A0008145938-1.pdf?src-supplier=IHS+Markit; ComponentLink1Description: https://datasheet.ciiva.com:443/pdfs/VipMasterIC/IC/YAGO/YAGO-S-A0008145938/YAGO-S-A0008145938-1.pdf?src-supplier=IHS+Markit; ComponentLink2URL: https://datasheet.ciiva.com/7983/1018594-7983501.pdf?src-supplier=Element14; ComponentLink2Description: https://datasheet.ciiva.com/7983/1018594-7983501.pdf?src-supplier=Element14; JLCPCB Part: C163478
R4 = RC0402FR-0747K5L: RES 47.5K OHM 1% 1/16W 0402; Manufacturer: Yageo; Additional Feature: LASER TRIMMABLE; Power: 62.5mW; Rated Temperature: 70°C; Value: 47.5kR; Working Voltage: 50V; Temperature Coefficient (ppm/Cel): 100; Package Height: 0.35mm; Package Length: 1mm; Package Width: 0.5mm; Supplier: Rs; Supplier Part Number: 1987797; Manufacturer Part Number: RC0402FR-0747K5L; RoHS: Yes; Category: Chip SMD Resistors; Stock: 1100; Pricing: 100=0,005, 1000=0,004, 2500=0,004, 5000=0,004, 10000=0,004 (EUR); Mounting Technology: Surface Mount; Pins: 2; Package Shape: Rectangular; Case/Package: 0402; Terminal Finish: Nickel; Min Operating Temperature: -55°C; Max Operating Temperature: 155°C; Tolerance: 1%; JESD-609 Code: e3; Resistor Type: FIXED RESISTOR; Construction: Chip; Packaging: Tape and Reel; Technology: METAL GLAZE/THICK FILM; Termination: Wraparound; Reach SVHC Compliant: Yes; RoHS Compliant: Yes; ComponentLink1URL: https://datasheet.ciiva.com:443/pdfs/VipMasterIC/IC/YAGO/YAGO-S-A0008145938/YAGO-S-A0008145938-1.pdf?src-supplier=IHS+Markit; ComponentLink1Description: https://datasheet.ciiva.com:443/pdfs/VipMasterIC/IC/YAGO/YAGO-S-A0008145938/YAGO-S-A0008145938-1.pdf?src-supplier=IHS+Markit; ComponentLink2URL: https://datasheet.ciiva.com/46394/1018594-46394942.pdf?src-supplier=Element14; ComponentLink2Description: https://datasheet.ciiva.com/46394/1018594-46394942.pdf?src-supplier=Element14; ComponentLink3URL: https://datasheet.ciiva.com/12667/pyu-rc0402-51-rohs-l-6-r-12667103.pdf?src-supplier=Mouser; ComponentLink3Description: https://datasheet.ciiva.com/12667/pyu-rc0402-51-rohs-l-6-r-12667103.pdf?src-supplier=Mouser; ComponentLink4URL: https://datasheet.ciiva.com/16746/pyu-rc0402-51-rohs-l-6-r-16746316.pdf?src-supplier=Future+Electronics; ComponentLink4Description: https://datasheet.ciiva.com/16746/pyu-rc0402-51-rohs-l-6-r-16746316.pdf?src-supplier=Future+Electronics; JLCPCB Part: C137974
R5 R6 = AC0402FR-075K1L: RES SMD 5.1K OHM 1% 1/16W 0402; Manufacturer: Yageo; Additional Feature: LASER TRIMMABLE; Power: 62.5mW; Rated Temperature: 70°C; Value: 5.1kR; Working Voltage: 50V; Temperature Coefficient (ppm/Cel): 100; Package Height: 0.32mm; Package Length: 1mm; Package Width: 0.5mm; Reference Standard: AEC-Q200; Supplier: Digikey; Supplier Part Number: YAG3503CT-ND; Manufacturer Part Number: AC0402FR-075K1L; RoHS: Yes; Category: Chip SMD Resistors; Stock: 47596; Pricing: 1=0,1, 10=0,01, 50=0,0086, 100=0,0071, 500=0,00612, 1000=0,0051, 5000=0,00408 (USD); Mounting Technology: Surface Mount; Pins: 2; Package Shape: Rectangular; Case/Package: 0402; Terminal Finish: Nickel; Min Operating Temperature: -55°C; Max Operating Temperature: 155°C; Tolerance: 1%; JESD-609 Code: e3; Resistor Type: FIXED RESISTOR; Construction: Chip; Packaging: Tape and Reel; Technology: METAL GLAZE/THICK FILM; Termination: Wraparound; Reach SVHC Compliant: Yes; RoHS Compliant: Yes; ComponentLink1URL: https://datasheet.ciiva.com:443/pdfs/VipMasterIC/IC/YAGO/YAGO-S-A0003597364/YAGO-S-A0003597364-1.pdf?src-supplier=IHS+Markit; ComponentLink1Description: https://datasheet.ciiva.com:443/pdfs/VipMasterIC/IC/YAGO/YAGO-S-A0003597364/YAGO-S-A0003597364-1.pdf?src-supplier=IHS+Markit; ComponentLink2URL: https://datasheet.octopart.com/AC0402FR-075K1L-Yageo-datasheet-166720450.pdf?src-supplier=Future+Electronics; ComponentLink2Description: https://datasheet.octopart.com/AC0402FR-075K1L-Yageo-datasheet-166720450.pdf?src-supplier=Future+Electronics; ComponentLink3URL: http://www.yageo.com/documents/recent/PYu-AC_51_RoHS_L_2_revised.pdf?src-supplier=Future+Electronics; ComponentLink3Description: http://www.yageo.com/documents/recent/PYu-AC_51_RoHS_L_2_revised.pdf?src-supplier=Future+Electronics; JLCPCB Part: C144745
R31 = RC0402FR-07100KL: RES 100K OHM 1% 1/16W 0402; Manufacturer: Yageo; Additional Feature: LASER TRIMMABLE; Power: 62.5mW; Rated Temperature: 70°C; Value: 100kR; Working Voltage: 50V; Temperature Coefficient (ppm/Cel): 100; Package Height: 0.35mm; Package Length: 1mm; Package Width: 0.5mm; Supplier: Rs; Supplier Part Number: 1987640; Manufacturer Part Number: RC0402FR-07100KL; RoHS: Yes; Category: Chip SMD Resistors; Stock: 26400; Pricing: 100=0,005, 500=0,004, 1000=0,004, 2500=0,004, 5000=0,003 (EUR); Mounting Technology: Surface Mount; Pins: 2; Package Shape: Rectangular; Case/Package: 0402; Terminal Finish: Nickel; Min Operating Temperature: -55°C; Max Operating Temperature: 155°C; Tolerance: 1%; JESD-609 Code: e3; Resistor Type: FIXED RESISTOR; Construction: Chip; Packaging: Tape and Reel; Technology: METAL GLAZE/THICK FILM; Termination: Wraparound; Reach SVHC Compliant: Yes; RoHS Compliant: Yes; ComponentLink1URL: https://datasheet.ciiva.com:443/pdfs/VipMasterIC/IC/YAGO/YAGO-S-A0008145938/YAGO-S-A0008145938-1.pdf?src-supplier=IHS+Markit; ComponentLink1Description: https://datasheet.ciiva.com:443/pdfs/VipMasterIC/IC/YAGO/YAGO-S-A0008145938/YAGO-S-A0008145938-1.pdf?src-supplier=IHS+Markit; ComponentLink2URL: https://datasheet.ciiva.com/11819/0900766b80c66297-11819452.pdf?src-supplier=Rs; ComponentLink2Description: https://datasheet.ciiva.com/11819/0900766b80c66297-11819452.pdf?src-supplier=Rs; ComponentLink3URL: https://datasheet.ciiva.com/12667/pyu-rc0402-51-rohs-l-6-r-12667930.pdf?src-supplier=Mouser; ComponentLink3Description: https://datasheet.ciiva.com/12667/pyu-rc0402-51-rohs-l-6-r-12667930.pdf?src-supplier=Mouser; ComponentLink4URL: https://datasheet.ciiva.com/15189/getdatasheetpartid-323696-15189334.pdf?src-supplier=Verical; ComponentLink4Description: https://datasheet.ciiva.com/15189/getdatasheetpartid-323696-15189334.pdf?src-supplier=Verical; ComponentLink5URL: https://datasheet.ciiva.com/22747/1018594-22747509.pdf?src-supplier=Element14; ComponentLink5Description: https://datasheet.ciiva.com/22747/1018594-22747509.pdf?src-supplier=Element14; ComponentLink6URL: https://datasheet.ciiva.com/2453/pyu-r-int-thick-7-2453362.pdf?src-supplier=Digikey; ComponentLink6Description: https://datasheet.ciiva.com/2453/pyu-r-int-thick-7-2453362.pdf?src-supplier=Digikey; ComponentLink7URL: https://datasheet.ciiva.com/2453/pyu-r-int-thick-7-2453363.pdf?src-supplier=Digikey; ComponentLink7Description: https://datasheet.ciiva.com/2453/pyu-r-int-thick-7-2453363.pdf?src-supplier=Digikey; ComponentLink8URL: https://datasheet.ciiva.com/2453/pyu-r-int-thick-7-2453361.pdf?src-supplier=Digikey; ComponentLink8Description: https://datasheet.ciiva.com/2453/pyu-r-int-thick-7-2453361.pdf?src-supplier=Digikey; JLCPCB Part: C60491
SW1 SW2 = PTS647SN50SMTR2LFS: SWITCH TACTILE SPST-NO 0.05A 12V; Manufacturer: ITT C&K; Supplier: Arrow Electronics; Supplier Part Number: PTS647SN50SMTR2LFS; Manufacturer Part Number: PTS647SN50SMTR2LFS; RoHS: No; Category: Tactile Switches; Stock: 10500; Pricing: 1500=0,1038 (USD); RoHS Compliant: Yes; ComponentLink1URL: https://www.ckswitches.com/media/2567/pts647.pdf?src-supplier=Digikey; ComponentLink1Description: https://www.ckswitches.com/media/2567/pts647.pdf?src-supplier=Digikey; ComponentLink2URL: https://datasheet.octopart.com/PTS647SN50SMTR2LFS-C%26K-Components-datasheet-117317067.pdf?src-supplier=Future+Electronics; ComponentLink2Description: https://datasheet.octopart.com/PTS647SN50SMTR2LFS-C%26K-Components-datasheet-117317067.pdf?src-supplier=Future+Electronics; ComponentLink3URL: https://datasheet.octopart.com/PTS647SN50SMTR2LFS-C%26K-Components-datasheet-156105943.pdf?src-supplier=TME; ComponentLink3Description: https://datasheet.octopart.com/PTS647SN50SMTR2LFS-C%26K-Components-datasheet-156105943.pdf?src-supplier=TME; JLCPCB Part: C2799414
U1 = CP2102N-A02-GQFN28: IC USB TO UART BRIDGE QFN28; Manufacturer: Silicon Labs; Supplier: Rs; Supplier Part Number: 1871341P; Manufacturer Part Number: CP2102N-A02-GQFN28; RoHS: Yes; Category: USB Interface ICs; Stock: 1963; Pricing: 40=2,763, 100=2,688, 200=2,613, 400=2,545 (EUR); ComponentLink1URL: https://datasheet.ciiva.com:443/pdfs/VipMasterIC/IC/SILC/SILC-S-A0007770867/SILC-S-A0007770867-1.pdf?src-supplier=IHS+Markit; ComponentLink1Description: https://datasheet.ciiva.com:443/pdfs/VipMasterIC/IC/SILC/SILC-S-A0007770867/SILC-S-A0007770867-1.pdf?src-supplier=IHS+Markit; JLCPCB Part: C1550553
U2 = ESP32-C3-MINI-1U-N4: RF TXRX MOD BT WIFIU.FL SMD; Manufacturer: Espressif Systems; Supplier: Digikey; Supplier Part Number: 1965-ESP32-C3-MINI-1U-N4CT-ND; Manufacturer Part Number: ESP32-C3-MINI-1U-N4; RoHS: No; Category: LDO; Stock: 5916; Pricing: 1=1,9 (USD); JLCPCB Part: C2911374
U3 = TCA9548APWR: IC BUS SWITCH 1 X 8:1 24TSSOP; Manufacturer: Texas Instruments; Package Body Material: Plastic; Output Polarity: True; Logic Type: MULTIPLEXER; Channels: 1; Number of Outputs: 8; Propagation Delay (tpd): 1ns; Max Supply Voltage: 5.5V; Min Supply Voltage: 1.65V; Nominal Supply Voltage: 1.8V; Supplier: Mouser; Supplier Part Number: 595-TCA9548APWR; Manufacturer Part Number: TCA9548APWR; RoHS: Yes; Category: Decoders and Multiplexers; Stock: 6650; Pricing: 1=1,17, 10=0,765, 50=0,765, 100=0,633, 1000=0,587, 10000=0,534 (USD); Case/Package: TSSOP; Pins: 24; Package Shape: Rectangular; Terminal Finish: Nickel; Min Operating Temperature: -40°C; Max Operating Temperature: 85°C; JESD-609 Code: e4; JESD-30 Code: R-PDSO-G24; Moisture Sensitivity Level: 1; Number of Inputs: 1; Package Style: SMALL OUTLINE, THIN PROFILE, SHRINK PITCHMeter; Peak Reflow Temperature (Cel): 260°C; Surface Mount: Yes; Terminal Form: Gull Wing; Terminal Position: DUAL; Length: 7.8mm; Width: 4.4mm; Height - Seated (Max): 1.2mm; Terminal Pitch: 0.65mm; Reach SVHC Compliant: Yes; RoHS Compliant: Yes; Temperature Grade: INDUSTRIAL; ComponentLink1URL: https://www.ti.com:443/lit/ds/symlink/tca9548a.pdf?src-supplier=IHS+Markit; ComponentLink1Description: https://www.ti.com:443/lit/ds/symlink/tca9548a.pdf?src-supplier=IHS+Markit; ComponentLink2URL: https://datasheet.ciiva.com/6614/tca9548a-6614721.pdf?src-supplier=Digikey; ComponentLink2Description: https://datasheet.ciiva.com/6614/tca9548a-6614721.pdf?src-supplier=Digikey; JLCPCB Part: C130026
U4 = TL1963A-33DCYR: Single Output Low Noise LDO, 1.5 A, Fixed 3.3 V Output, 2.1 to 20 V Input, 4-pin SOT-223 (DCY), -40 to 125 degC, Green (RoHS & no Sb/Br); Manufacturer: Texas Instruments; Vout Adj(Min)(V): 3.3; Vin(Max)(V): 20; SubFamily: Single Channel LDO; Iq(Typ)(mA): 1; Iout(Max)(A): 1.5; Vin(Min)(V): 2.1; Vdo(Typ)(mV): 340; Accuracy(%): 3; ComponentLink2Description: Datasheet; PackageVersion: 4202506/B; PackageReference: DCY0004A; ComponentLink1Description: Manufacturer URL; Eco-Plan: Green (RoHS & no Sb/Br); ComponentLink1URL: http://www.ti.com/; Fixed Output Options(V): 3.3; ComponentLink2URL: http://www.ti.com/general/docs/lit/getliterature.tsp?genericPartNumber=TL1963A-33&fileType=pdf; Vout Adj(Max)(V): 3.3; PackageDescription: 4-Pin Plastic Small Outline, Body 3.5 x 6.5 mm, Pitch 2.3 mm; ComponentLink3URL: http://www.ti.com/litv/pdf/mpds094a; DatasheetVersion: SLVS719F; PartNumber: TL1963A-33DCYR; Code_JEDEC: TO-261; Mounting Technology: Surface Mount; ComponentLink3Description: Package Specification; JLCPCB Part: C181262
U5-U12 = DRV2605LDGSR: IC MOTOR DRIVER 2V-5.5V 10VSSOP; Manufacturer: Texas Instruments; Package Body Material: Plastic; Throw Configuration: ANALOG CIRCUIT; Channels: 1; Max Supply Voltage: 5.2V; Min Supply Voltage: 2V; Nominal Supply Voltage: 3.6V; Supplier: Mouser; Supplier Part Number: 595-DRV2605LDGSR; Manufacturer Part Number: DRV2605LDGSR; RoHS: Yes; Category: Motor Drivers; Stock: 10057; Pricing: 1=2,27, 10=1,61, 50=1,61, 100=1,45, 1000=1,31, 10000=1,3 (USD); Case/Package: TSSOP; Pins: 10; Package Shape: Square; Terminal Finish: Nickel; Min Operating Temperature: -40°C; Max Operating Temperature: 85°C; JESD-609 Code: e4; JESD-30 Code: S-PDSO-G10; Moisture Sensitivity Level: 2; Package Style: SMALL OUTLINE, THIN PROFILE, SHRINK PITCHMeter; Peak Reflow Temperature (Cel): 260°C; Surface Mount: Yes; Terminal Form: Gull Wing; Terminal Position: DUAL; Length: 3mm; Width: 3mm; Height - Seated (Max): 1.1mm; Terminal Pitch: 0.5mm; Temperature Grade: INDUSTRIAL; Reach SVHC Compliant: Yes; RoHS Compliant: Yes; ComponentLink1URL: https://www.ti.com:443/lit/ds/symlink/drv2605l.pdf?src-supplier=IHS+Markit; ComponentLink1Description: https://www.ti.com:443/lit/ds/symlink/drv2605l.pdf?src-supplier=IHS+Markit; ComponentLink2URL: http://www.ti.com/lit/ds/symlink/drv2605l.pdf?src-supplier=Digikey; ComponentLink2Description: http://www.ti.com/lit/ds/symlink/drv2605l.pdf?src-supplier=Digikey; ComponentLink3URL: http://www.ti.com/general/docs/lit/getliterature.tsp?genericPartNumber=DRV2605L&&fileType=pdf&src-supplier=Avnet; ComponentLink3Description: http://www.ti.com/general/docs/lit/getliterature.tsp?genericPartNumber=DRV2605L&&fileType=pdf&src-supplier=Avnet; JLCPCB Part: C527464
U13 = MCP73831T-2ACI/OT: IC BATT CNTL LI-ION 1CEL SOT23-5; Manufacturer: Microchip; Package Body Material: Plastic; Adjustable Threshold: Yes; Throw Configuration: POWER SUPPLY SUPPORT CIRCUIT; Number of Channels: 1; Package Equivalence Code: TSOP5/6,.11,37; Power Supplies: 3.3/5V; Supply Current-Max (Isup): 1.5mA; Max Supply Voltage: 6V; Min Supply Voltage: 3.75V; Nominal Supply Voltage: 5.2V; Time @ Peak Reflow Temperature-Max (s): 40s; Qualification Status: Not Qualified; Supplier: Digikey; Supplier Part Number: MCP73831T-2ACI/OTCT-ND; Manufacturer Part Number: MCP73831T-2ACI/OT; RoHS: Yes; Category: Battery Management; Stock: 84522; Pricing: 1=0,76, 25=0,63, 100=0,6125 (USD); Case/Package: LSSOP; Pins: 5; Package Shape: Rectangular; Terminal Finish: Tin; Min Operating Temperature: -40°C; Max Operating Temperature: 85°C; JESD-609 Code: e3; JESD-30 Code: R-PDSO-G5; Moisture Sensitivity Level: 1; Channels: 1; Package Style: SMALL OUTLINE, LOW PROFILE, SHRINK PITCHMeter; Peak Reflow Temperature (Cel): 260°C; Surface Mount: Yes; Terminal Form: Gull Wing; Terminal Position: DUAL; Length: 2.95mm; Width: 1.65mm; Height - Seated (Max): 1.45mm; Terminal Pitch: 0.95mm; Temperature Grade: INDUSTRIAL; Reach SVHC Compliant: Yes; RoHS Compliant: Yes; ComponentLink1URL: https://datasheet.ciiva.com:443/pdfs/VipMasterIC/IC/MCHP/MCHPS05673/MCHPS05673-1.pdf?src-supplier=IHS+Markit; ComponentLink1Description: https://datasheet.ciiva.com:443/pdfs/VipMasterIC/IC/MCHP/MCHPS05673/MCHPS05673-1.pdf?src-supplier=IHS+Markit; ComponentLink2URL: https://datasheet.ciiva.com/22828/0900766b80d2b53a-22828876.pdf?src-supplier=Rs; ComponentLink2Description: https://datasheet.ciiva.com/22828/0900766b80d2b53a-22828876.pdf?src-supplier=Rs; ComponentLink3URL: https://datasheet.ciiva.com/26344/651521-da-01-en-contr-mcp73831t-2aci-ot-sot-23-5-mcp-26344458.pdf?src-supplier=Conrad; ComponentLink3Description: https://datasheet.ciiva.com/26344/651521-da-01-en-contr-mcp73831t-2aci-ot-sot-23-5-mcp-26344458.pdf?src-supplier=Conrad; ComponentLink4URL: https://datasheet.ciiva.com/1137/630369-1137803.pdf?src-supplier=Element14; ComponentLink4Description: https://datasheet.ciiva.com/1137/630369-1137803.pdf?src-supplier=Element14; ComponentLink5URL: https://datasheet.ciiva.com/46385/630369-46385324.pdf?src-supplier=Element14; ComponentLink5Description: https://datasheet.ciiva.com/46385/630369-46385324.pdf?src-supplier=Element14; ComponentLink6URL: https://datasheet.ciiva.com/16286/filehandler-aspxddocname-en025112-16286957.pdf?src-supplier=Future+Electronics; ComponentLink6Description: https://datasheet.ciiva.com/16286/filehandler-aspxddocname-en025112-16286957.pdf?src-supplier=Future+Electronics; ComponentLink7URL: https://datasheet.ciiva.com/1931/21984e-1931954.pdf?src-supplier=Digikey; ComponentLink7Description: https://datasheet.ciiva.com/1931/21984e-1931954.pdf?src-supplier=Digikey; ComponentLink8URL: https://datasheet.ciiva.com/1931/21984e-1931955.pdf?src-supplier=Digikey; ComponentLink8Description: https://datasheet.ciiva.com/1931/21984e-1931955.pdf?src-supplier=Digikey; ComponentLink9URL: https://datasheet.ciiva.com/1931/21984e-1931953.pdf?src-supplier=Digikey; ComponentLink9Description: https://datasheet.ciiva.com/1931/21984e-1931953.pdf?src-supplier=Digikey; ComponentLink10URL: https://datasheet.ciiva.com/28626/630369-28626439.pdf?src-supplier=Element14; ComponentLink10Description: https://datasheet.ciiva.com/28626/630369-28626439.pdf?src-supplier=Element14; ComponentLink11URL: https://datasheet.ciiva.com/1144/630369-1144461.pdf?src-supplier=Newark; ComponentLink11Description: https://datasheet.ciiva.com/1144/630369-1144461.pdf?src-supplier=Newark; JLCPCB Part: C424093